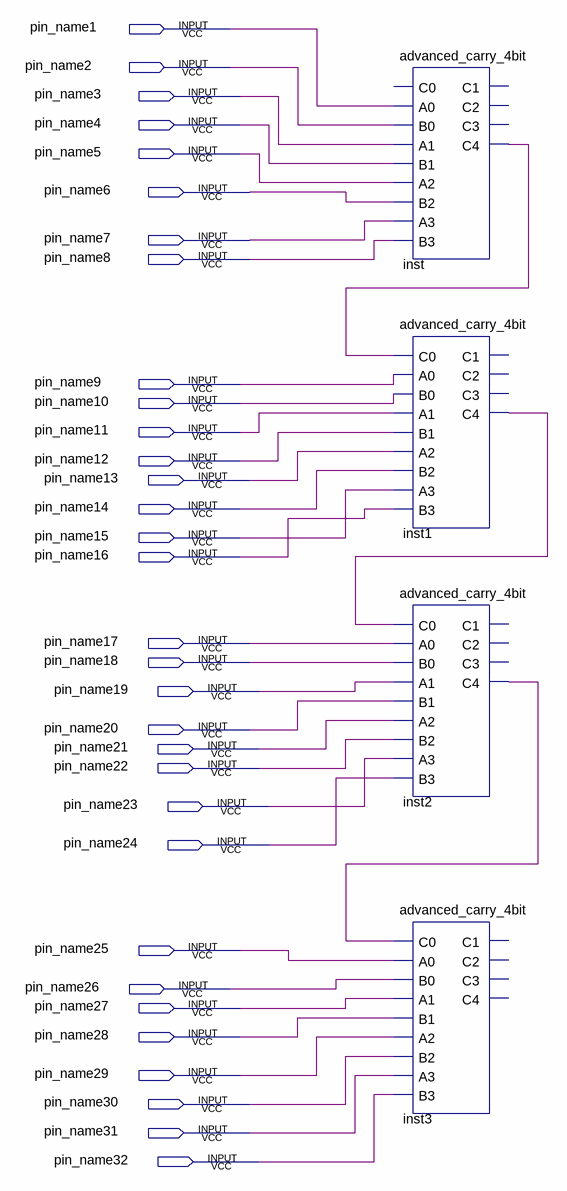
[diagram p0: schematic sheet]
// Quartus schematic test_adder.bdf as structural Verilog: 4 symbols, 32 pins
module test_adder (
  input  pin_name1,
  input  pin_name2,
  input  pin_name3,
  input  pin_name4,
  input  pin_name5,
  input  pin_name6,
  input  pin_name7,
  input  pin_name8,
  input  pin_name9,
  input  pin_name10,
  input  pin_name11,
  input  pin_name12,
  input  pin_name13,
  input  pin_name14,
  input  pin_name15,
  input  pin_name16,
  input  pin_name17,
  input  pin_name18,
  input  pin_name19,
  input  pin_name20,
  input  pin_name21,
  input  pin_name22,
  input  pin_name23,
  input  pin_name24,
  input  pin_name25,
  input  pin_name26,
  input  pin_name27,
  input  pin_name28,
  input  pin_name29,
  input  pin_name30,
  input  pin_name31,
  input  pin_name32
);

  wire inst1_c4, inst2_c4, inst_c4;

  advanced_carry_4bit inst (
    .A0(pin_name1), .B0(pin_name2), .A1(pin_name3), .B1(pin_name4), .A2(pin_name5), .B2(pin_name6),
    .A3(pin_name7), .B3(pin_name8), .C4(inst_c4));  // open: C0, C1, C2, C3
  advanced_carry_4bit inst1 (
    .C0(inst_c4), .A0(pin_name9), .B0(pin_name10), .A1(pin_name11), .B1(pin_name12), .A2(pin_name13),
    .B2(pin_name14), .A3(pin_name15), .B3(pin_name16), .C4(inst1_c4));  // open: C1, C2, C3
  advanced_carry_4bit inst2 (
    .C0(inst1_c4), .A0(pin_name17), .B0(pin_name18), .A1(pin_name19), .B1(pin_name20), .A2(pin_name21),
    .B2(pin_name22), .A3(pin_name23), .B3(pin_name24), .C4(inst2_c4));  // open: C1, C2, C3
  advanced_carry_4bit inst3 (
    .C0(inst2_c4), .A0(pin_name25), .B0(pin_name26), .A1(pin_name27), .B1(pin_name28), .A2(pin_name29),
    .B2(pin_name30), .A3(pin_name31), .B3(pin_name32));  // open: C1, C2, C3, C4
endmodule
